# EasyEDA Pro project T113 IoT Station.eprj, schematic Schematic1

## Sheets
1 CPU: Create Date: 2023-01-01; Page Name: CPU; Project Name: T113 IoT Station; Schematic Name: Schematic1; Update Date: 2023-01-26; Company: 嘉立创EDA; Page Size: A3; Version: V1.0
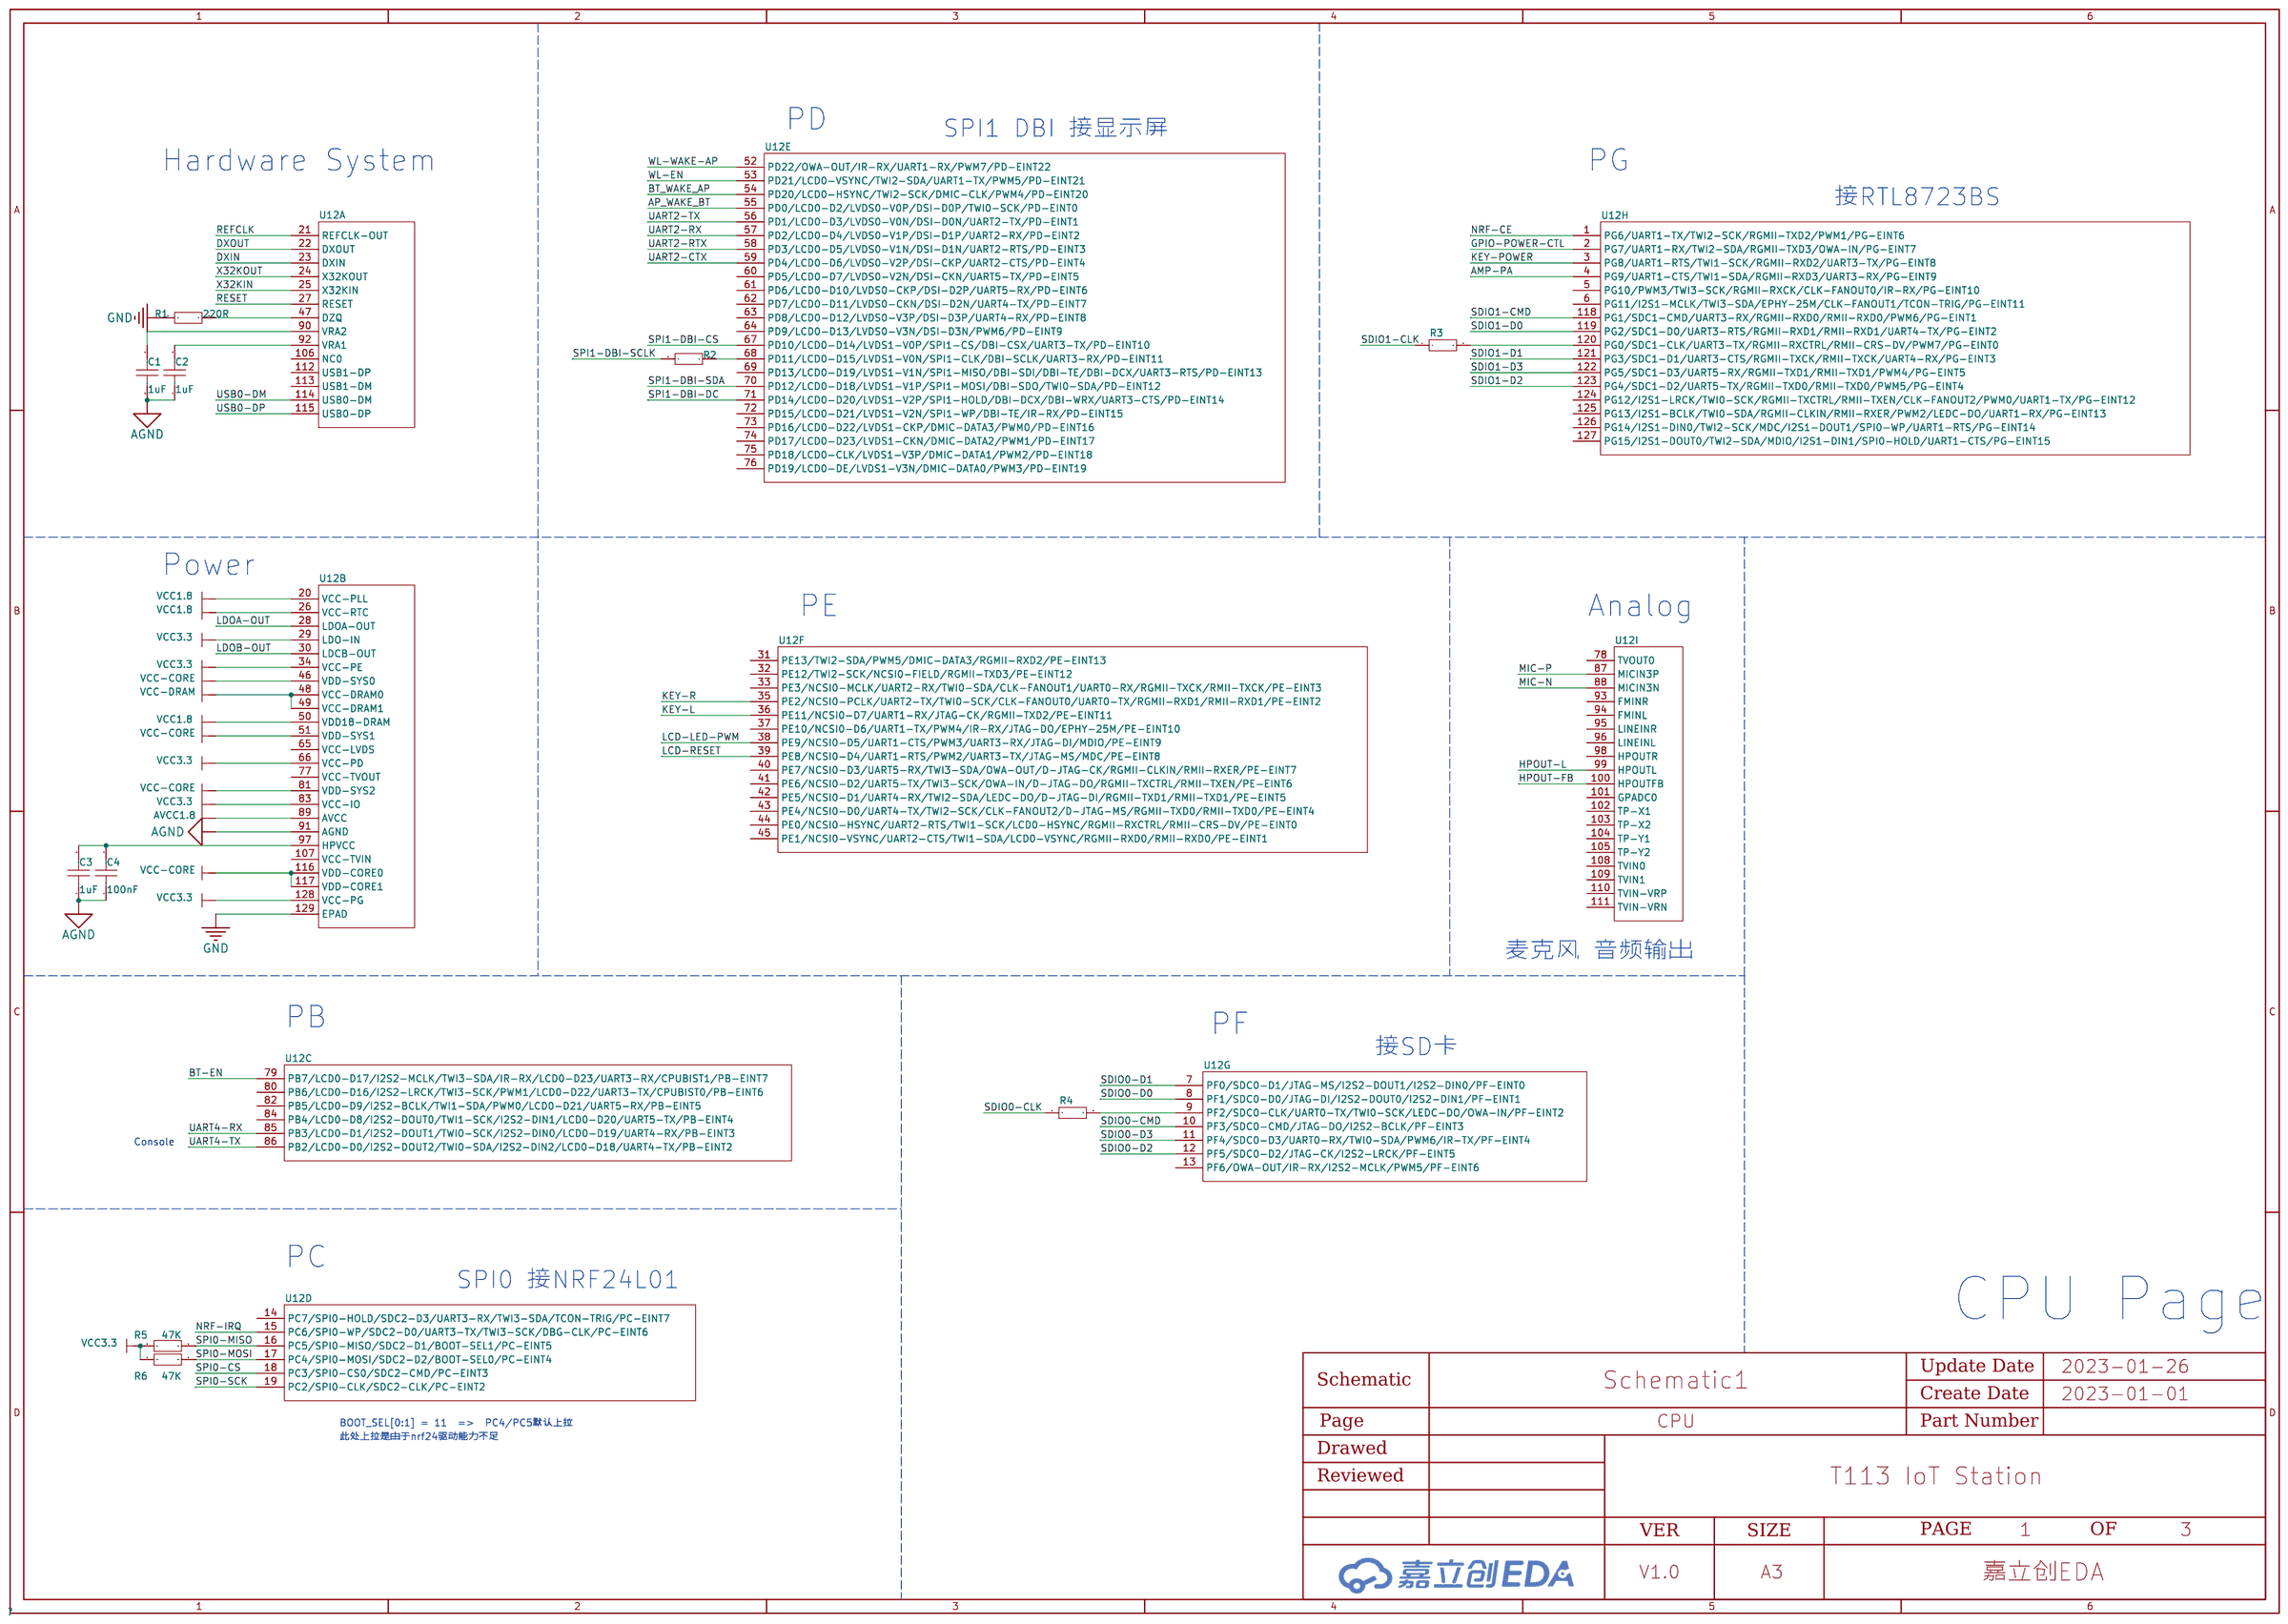
[diagram p0: CPU]
2 Power&System: Page Name: Power&System; Update Date: 2023-01-03; Page Size: A4
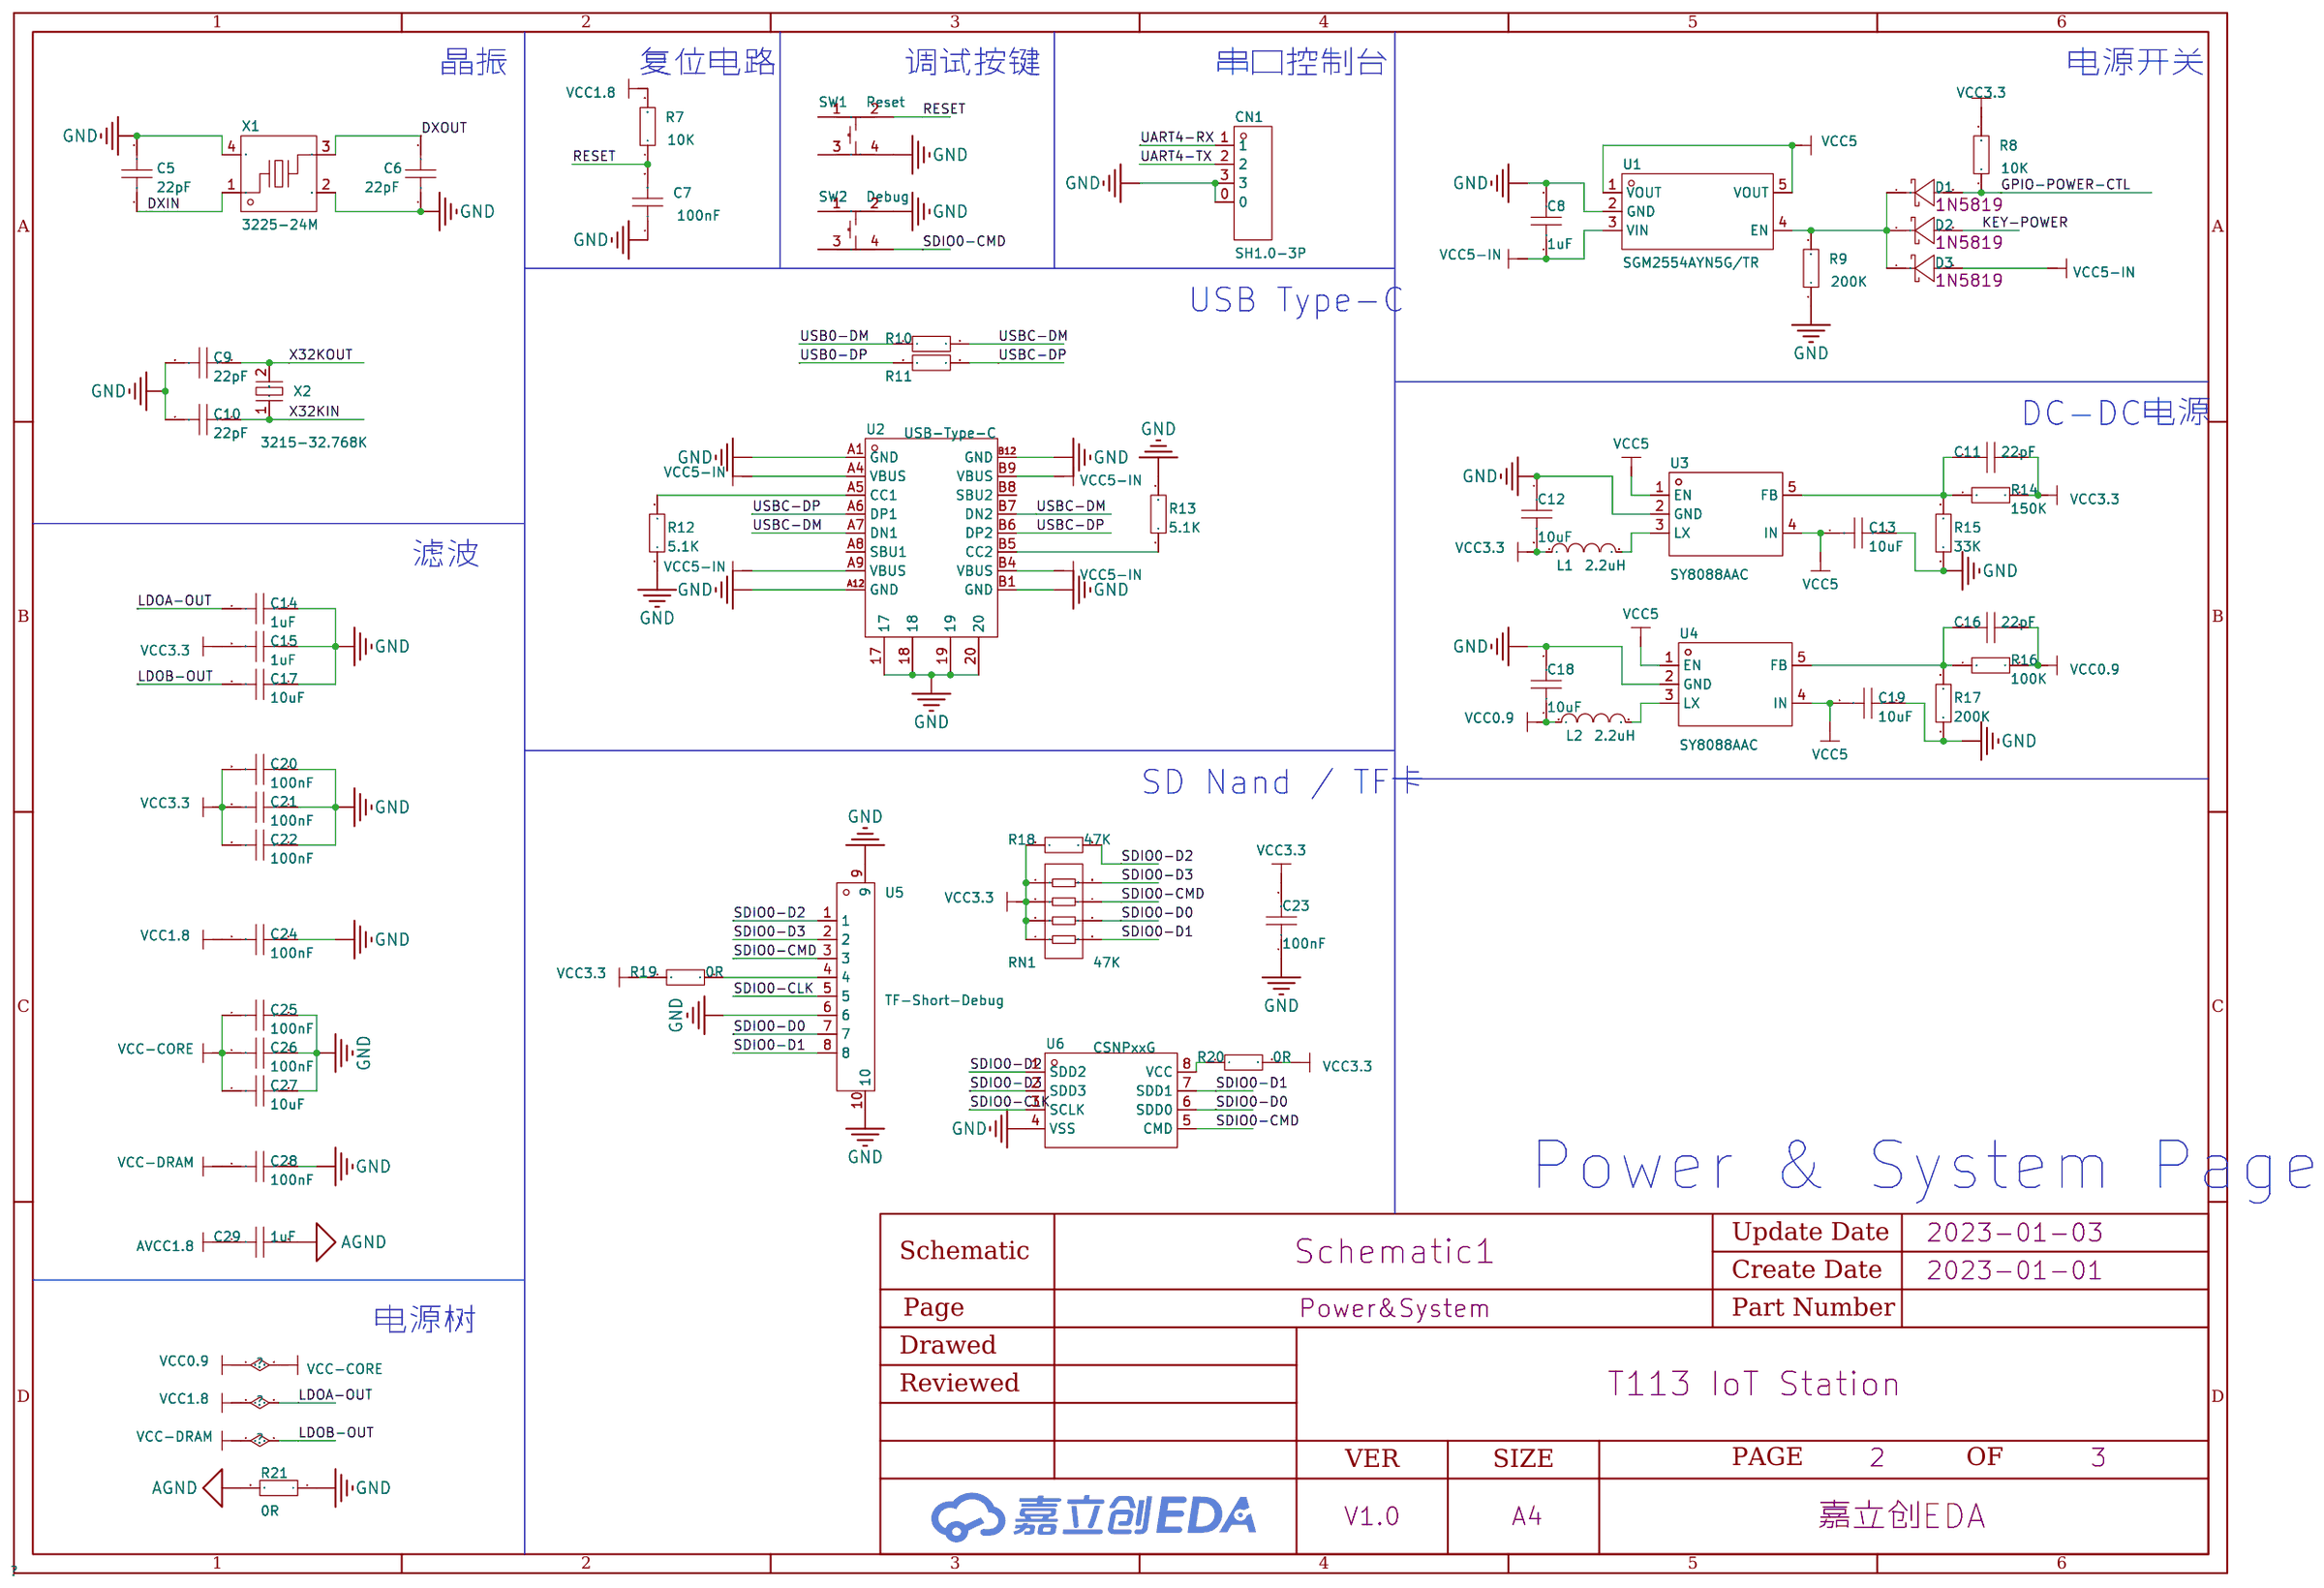
[diagram p1: Power&System]
3 Peripheral: Page Name: Peripheral; Page Size: A4
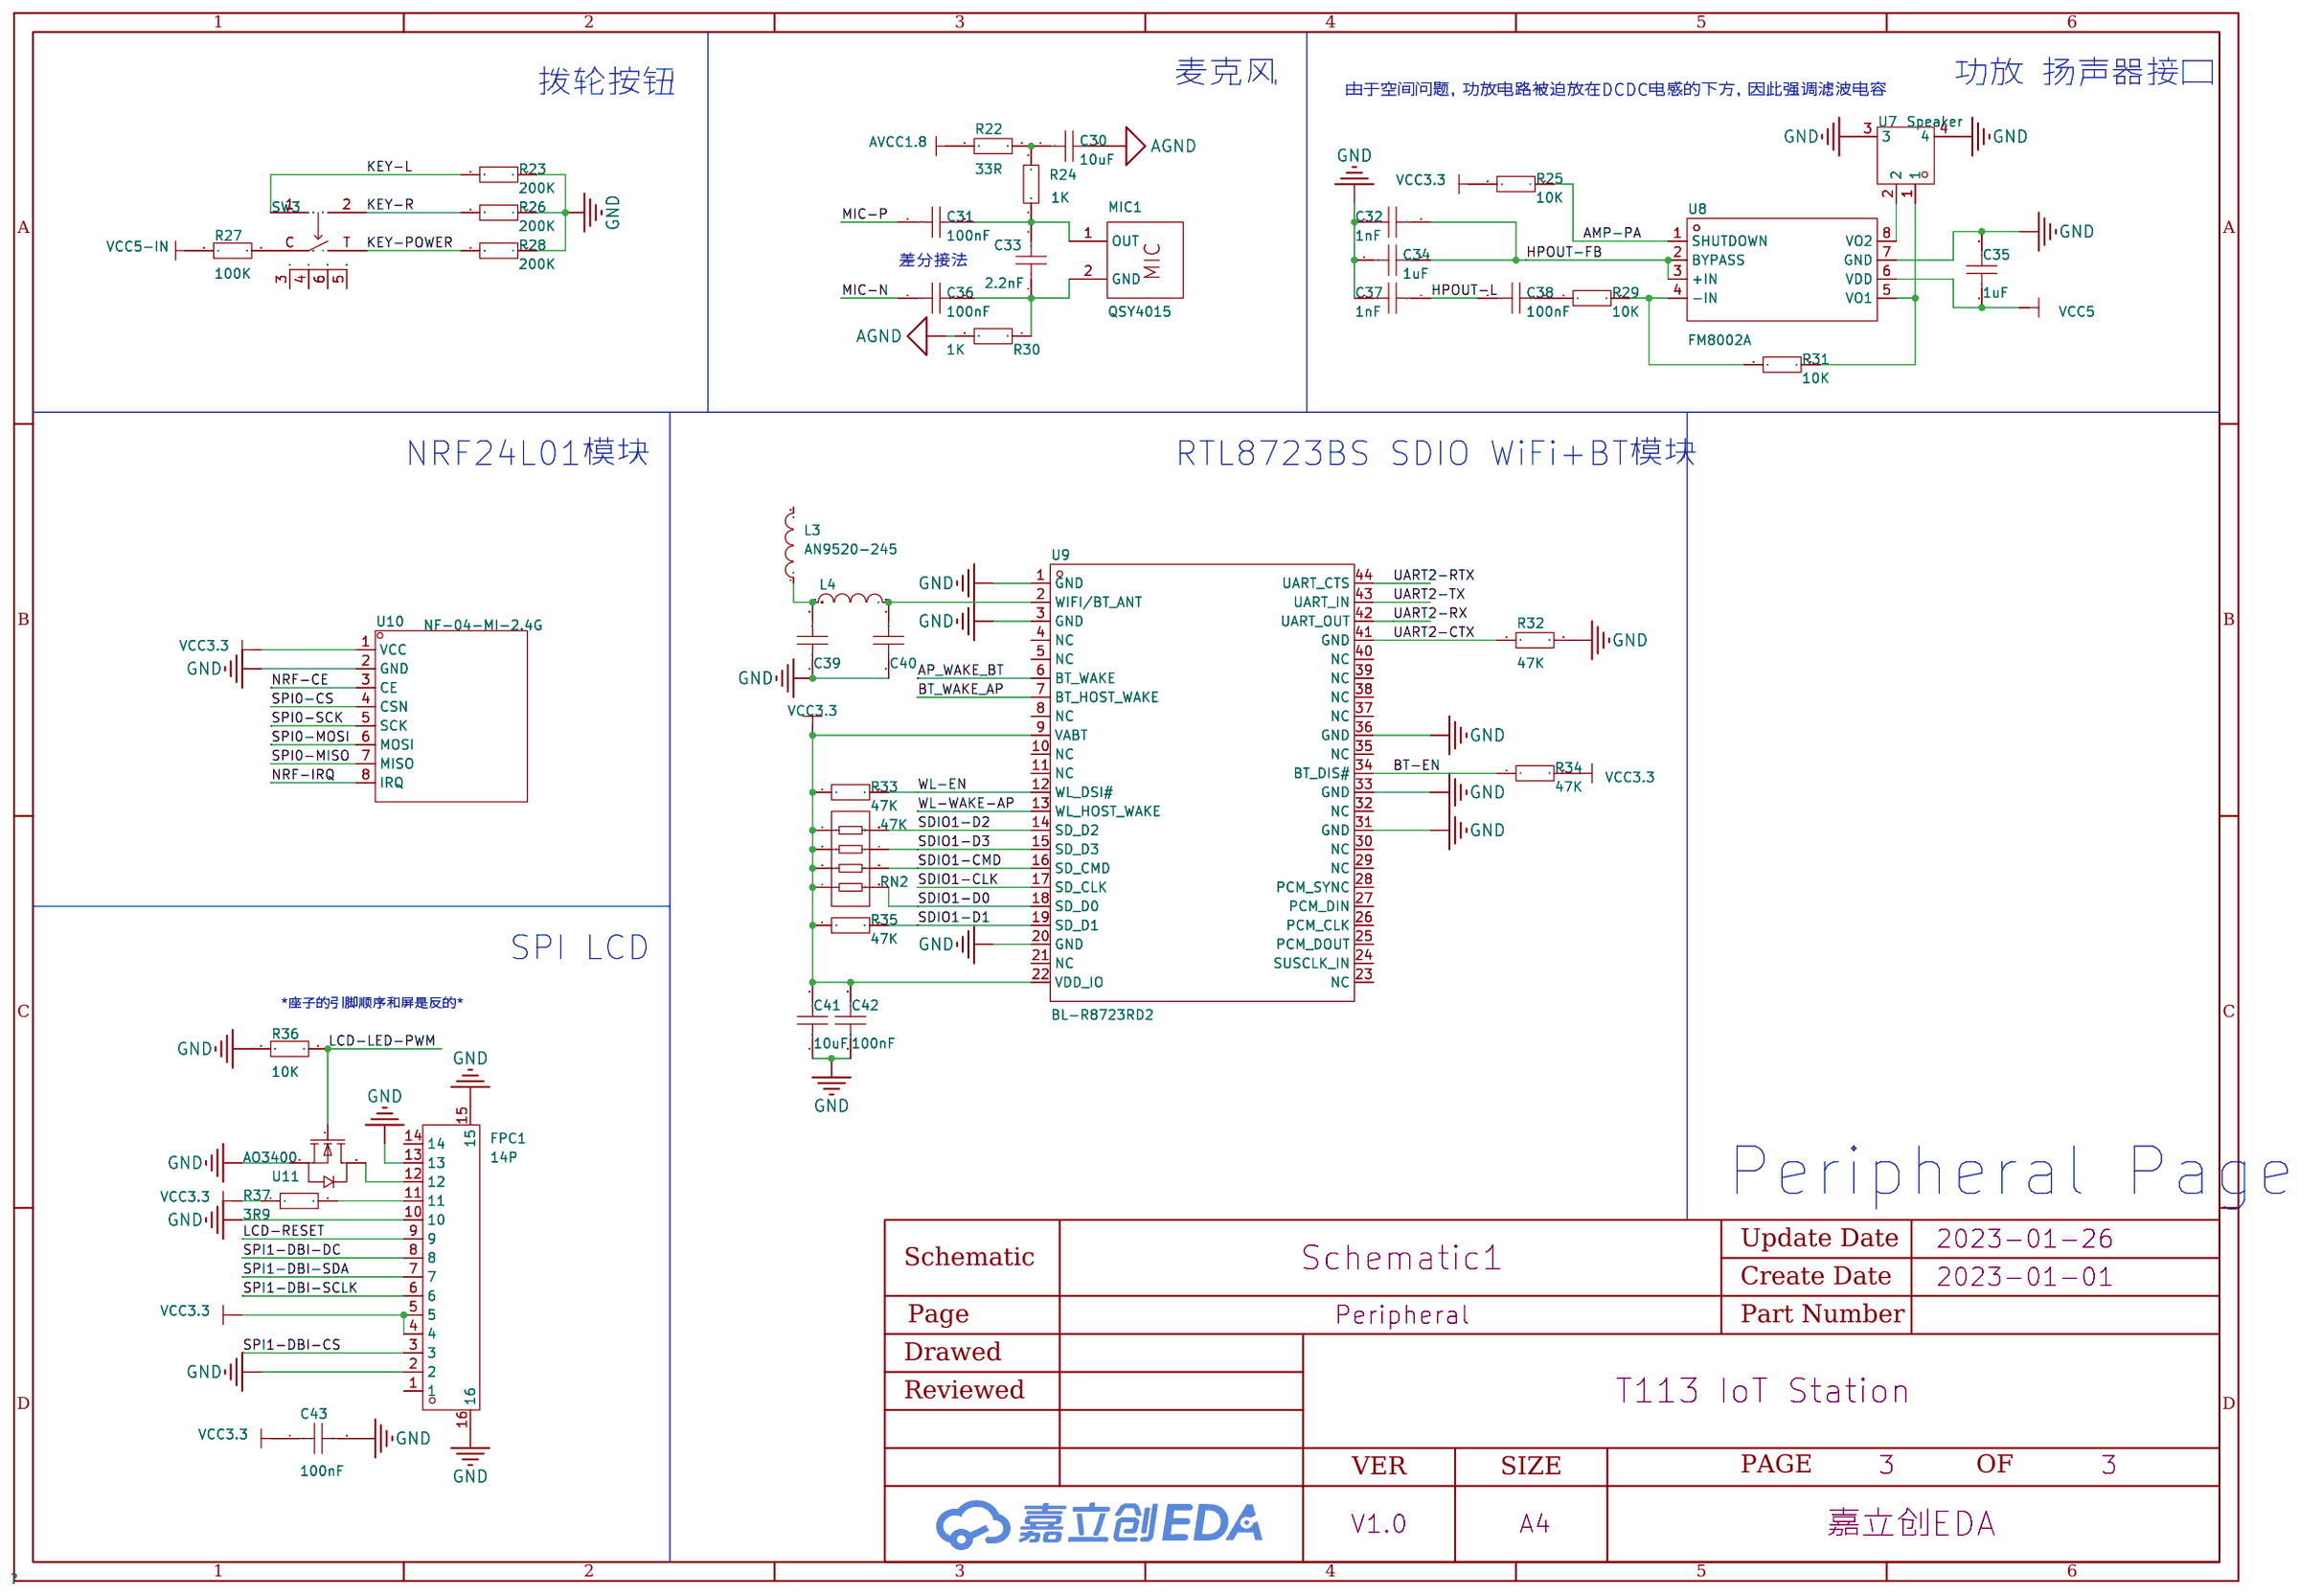
[diagram p2: Peripheral]

## Parts
sheet CPU
C1  1uF  [C0603]
C2  1uF  [C0603]
C3  1uF  [C0603]
C4  100nF  [C0603]
R1  220R  [R0603]
R2  10K  [R0603]
R3  33R  [R0603]
R4  33R  [R0603]
R5  47K  [R0603]
R6  47K  [R0603]
U12  -  [eLQFP-128-5.8]  (sections Analog,PB,PC,PD,PE,PF,PG,Power,System)
sheet Peripheral
C30  10uF  [C0603]
C31  100nF  [C0603]
C32  1nF  [C0603]
C33  2.2nF  [C0603]
C34  1uF  [C0603]
C35  1uF  [C0603]
C36  100nF  [C0603]
C37  1nF  [C0603]
C38  100nF  [C0603]
C39  100nF  [C0402]
C40  100nF  [C0402]
C41  10uF  [C0603]
C42  100nF  [C0603]
C43  100nF  [C0603]
FPC1  14P  [FPC-SMD_14P-P0.50_HDGC_0.5K-AS-14PWB]
L3  AN9520-245  [ANT-SMD_L9.5-W2.1]
L4  2.2nH  [L0402-RD]
MIC1  QSY4015  [MIC-TH_BD4.0-P1.40-D0.3-L]
R22  33R  [R0603]
R23  200K  [R0603]
R24  1K  [R0603]
R25  10K  [R0603]
R26  200K  [R0603]
R27  100K  [R0603]
R28  200K  [R0603]
R29  10K  [R0603]
R30  1K  [R0603]
R31  10K  [R0603]
R32  47K  [R0603]
R33  47K  [R0603]
R34  47K  [R0603]
R35  47K  [R0603]
R36  10K  [R0603]
R37  3R9  [R0603]
RN2  47K  [RES-ARRAY-SMD_0603-8P-L3.2-W1.6-BL]
SW3  TM-2023  [SW-SMD_TM-2023-1]
U7  Speaker  [CONN-SMD_2P-P1.25_HANBO_WAFER-125W-2A]
U8  FM8002A  [SOP-8_L4.9-W3.9-P1.27-LS6.0-BL]
U9  BL-R8723RD2  [WIFIM-SMD_44P-L12.0-W12.0-P0.90]
U10  NF-04-MI-2.4G  [WIRELM-SMD_NF-04-MI-2.4G]
U11  AO3400  [SOT-23-3_L2.9-W1.3-P1.90-LS2.4-BL-2]
sheet Power&System
C5  22pF  [C0402]
C6  22pF  [C0402]
C7  100nF  [C0603]
C8  1uF  [C0603]
C9  22pF  [C0402]
C10  22pF  [C0402]
C11  22pF  [C0402]
C12  10uF  [C0603]
C13  10uF  [C0603]
C14  1uF  [C0603]
C15  1uF  [C0603]
C16  22pF  [C0402]
C17  10uF  [C0603]
C18  10uF  [C0603]
C19  10uF  [C0603]
C20  100nF  [C0603]
C21  100nF  [C0603]
C22  100nF  [C0603]
C23  100nF  [C0603]
C24  100nF  [C0603]
C25  100nF  [C0603]
C26  100nF  [C0603]
C27  10uF  [C0603]
C28  100nF  [C0603]
C29  1uF  [C0603]
CN1  SH1.0-3P  [CONN-SMD_3P-P1.00-L5.0-W5.0]
D1  1N5819  [SOD-323_L1.6-W1.3-LS2.7-RD]
D2  1N5819  [SOD-323_L1.6-W1.3-LS2.7-RD]
D3  1N5819  [SOD-323_L1.6-W1.3-LS2.7-RD]
L1  2.2uH  [IND-SMD_L3.0-W3.0]
L2  2.2uH  [IND-SMD_L3.0-W3.0]
R7  10K  [R0603]
R8  10K  [R0603]
R9  200K  [R0603]
R10  90R  [R0603]
R11  90R  [R0603]
R12  5.1K  [R0603]
R13  5.1K  [R0603]
R14  150K  [R0603]
R15  33K  [R0603]
R16  100K  [R0603]
R17  200K  [R0603]
R18  47K  [R0603]
R19  0R  [R0603]
R20  0R  [R0603]
R21  0R  [R0603]
RN1  47K  [RES-ARRAY-SMD_0603-8P-L3.2-W1.6-BL]
SW1  Reset  [SW-SMD_4P-L3.5-W3.4-P2.20-LS4.2]
SW2  Debug  [SW-SMD_4P-L3.5-W3.4-P2.20-LS4.2]
U1  SGM2554AYN5G/TR  [SOT-23-5_L3.0-W1.7-P0.95-LS2.8-BR]
U2  USB-Type-C  [USB-C-SMD_KH-TYPE-C-CB.W-16P]
U3  SY8088AAC  [SOT-23-5_L3.0-W1.7-P0.95-LS2.8-BR]
U4  SY8088AAC  [SOT-23-5_L3.0-W1.7-P0.95-LS2.8-BR]
U5  TF-Short-Debug  [TF-SMD_TF-021B-H265-C9900005422]
U6  CSNPxxG  [LGA-8_L8.0-W6.2-TL]
X1  3225-24M  [CRYSTAL-SMD_4P-L3.2-W2.5-BL_SIT8008BI]
X2  3215-32.768K  [CRYSTAL-SMD_L3.2-W1.5-FC-135R32.7680KF-A3]

## Library data of the parts
C1-C38 C41-C43 = CAP_0603: Supplier Footprint: 0603
R1-R37 = Res_0603: Supplier Footprint: 0603
U12 = T113-S3
C39 C40 = CL05B104KB54PNC: 容值:100nF;精度:±10%;额定电压:50V;材质(温度系数):X7R;; LCSC Part Name: 100nF ±10% 50V; Supplier Part: C307331; Manufacturer: SAMSUNG(三星); Supplier Footprint: 0402; JLCPCB Part Class: Basic Part; Datasheet: https://atta.szlcsc.com/upload/public/pdf/source/20181009/C307331_222F7C870FD3EA5F46F538B483443886.pdf; Supplier: LCSC; Tolerance: ±10%; Voltage Rated: 50V; Temperature Coefficient: X7R
FPC1 = 0.5K-AS-14PWB: 间距:0.5mm;触点数量:14;锁定特性:抽屉式;安装类型:卧贴;触点类型:上接;工作温度范围:-20℃~+85℃;; LCSC Part Name: 0.5mm P数:14 抽屉式 上接; Supplier Part: C2911757; Manufacturer: HDGC(华德共创); Supplier Footprint: SMD,P=0.5mm; JLCPCB Part Class: 扩展库; Datasheet: https://atta.szlcsc.com/upload/public/pdf/source/20211029/A754EE7947D21442D1C5341E4B9485D9.pdf; Supplier: LCSC; Pitch: 0.5mm; Number of Contacts: 14; Locking Feature: 抽屉式; Mounting Type: 卧贴; Contact Type: 上接; Height Above Board: 2mm; FFC, FCB Thickness: 0.3mm; Operating Temperature Range: -20℃~+85℃
L3 = AN9520-245: 2.4G陶瓷天线/适用于WIFI蓝牙; Supplier Part: C99665; Manufacturer: rainsun(霖昱微); Supplier Footprint: SMD,9.5x2.1mm; JLCPCB Part Class: 扩展库; Datasheet: https://atta.szlcsc.com/upload/public/pdf/source/20170425/1493115807294.pdf; Supplier: LCSC
L4 = SDCL1005C2N2STDFM02: 电感值:2.2nH;精度:±0.3nH;额定电流:-;饱和电流(Isat):-;直流电阻(DCR):-;; LCSC Part Name: 2.2nH ±0.3nH; Supplier Part: C370208; Manufacturer: Sunlord(顺络); Supplier Footprint: 0402; JLCPCB Part Class: Extended Part; Datasheet: https://atta.szlcsc.com/upload/public/pdf/source/20210916/2389196E6DC4CA1121B2D3610B126F46.pdf; Supplier: LCSC; Tolerance: ±0.3nH
MIC1 = B4012AP422-003: LCSC Part Name: 驻极体电容φ4.0*1.2mm 1.1V-10V 灵敏度-42dB; Supplier Part: C233791; Manufacturer: Goertek(歌尔); Supplier Footprint: 插件; JLCPCB Part Class: 扩展库; Datasheet: https://atta.szlcsc.com/upload/public/pdf/source/20180813/C233791_EB931036CBE94BDAE55CF8920DD0A876.pdf; Supplier: LCSC
RN1 RN2 = 4D03WGF4702T5E: 阻值:47kΩ;精度:±1%;单个元件功率:62.5mW;温度系数:±200ppm/℃;电阻器数:4;引脚数:8;; LCSC Part Name: 47kΩ ±1%; Supplier Part: C425205; Manufacturer: UNI-ROYAL(厚声); Supplier Footprint: 0603x4; JLCPCB Part Class: 扩展库; Datasheet: https://atta.szlcsc.com/upload/public/pdf/source/20190904/C425205_39C055B61BC6450B3A5566E7DE8F575E.pdf; Supplier: LCSC; Tolerance: ±1%; Power(Watts): 62.5mW; Temperature Coefficient: ±200ppm/℃; Number of Resistors: 4; Number of Pins: 8
SW3 = TM-2023: 3挡拨轮开关  音响周边开关 多功能开关上中下按键; LCSC Part Name: 3挡拨轮开关; Supplier Part: C318951; Manufacturer: XKB Connectivity(中国星坤); Supplier Footprint: SMD; JLCPCB Part Class: 扩展库; Datasheet: https://atta.szlcsc.com/upload/public/pdf/source/20211015/4E21B3A9DEF1E687333BA1DF36F89D09.pdf; Supplier: LCSC
U7 = UK-1.25-2AWT: 间距:1.25mm;排数:1;每排PIN数:2;公母:公型插针;安装方式:卧贴;额定电流:1A;工作温度范围:-25℃~+85℃;; LCSC Part Name: 1.25mm 卧贴 卧式; Supplier Part: C2997376; Manufacturer: USAKRO(美韩); Supplier Footprint: SMD,P=1.25mm; Datasheet: https://atta.szlcsc.com/upload/public/pdf/source/20220419/24A4256629D7E8D61BFE5BCA4B394246.pdf; Supplier: LCSC; Pitch: 1.25mm; Number of Rows: 1; Number of PINs Per Row: 2; Gender: 公型插针; Mounting Style: 卧贴; Current Rating (Max): 1A; Operating Temperature Range: -25℃~+85℃
U8 = FM8002A: 功放类型:-;扬声器通道数:1通道(单声道);输出功率:2Wx1@4Ω;; Supplier Part: C94625; Manufacturer: FM(富满); Supplier Footprint: SOP-8; JLCPCB Part Class: 扩展库; Datasheet: https://atta.szlcsc.com/upload/public/pdf/source/20170211/1486785664274.pdf; Supplier: LCSC; Speaker Channels: 1通道(单声道); Output Power: 2Wx1@4Ω; Supply Voltage: 2.5V~5.5V
U9 = BL-R8723BS2: Supplier Part: C9900000432; Supplier Footprint: SMD-44_12.0x12.0x0.90P; JLCPCB Part Class: 扩展库; Datasheet: https://atta.szlcsc.comnull; Supplier: LCSC
U10 = NF-04-MI-2.4G: 迷你 无线模块 2.4G模块 无线串口模块 贴片 插件两用; LCSC Part Name: NF-04-MI-2.4G 迷你 无线串口; Supplier Part: C129093; Manufacturer: Ai-Thinker(安信可); Supplier Footprint: Module; JLCPCB Part Class: 扩展库; Datasheet: https://atta.szlcsc.com/upload/public/pdf/source/20170914/C129093_1505359896154968085.pdf; Supplier: LCSC
U11 = AO3400: Supplier Part: C9900013365; Supplier Footprint: SOT23; JLCPCB Part Class: 扩展库; Datasheet: 2022-04-08/830516A/bc9ad5c09bcf47d2b260b07161827fa1/AO3400A.PDF; Supplier: LCSC
CN1 = SH1.0-3P: Supplier Part: C9900019066; JLCPCB Part Class: 扩展库; Datasheet: https://atta.szlcsc.comnull; Supplier: LCSC
D1-D3 = 1N5819WS_C727116: 二极管配置:独立式;直流反向耐压(Vr):40V;平均整流电流(Io):1A;正向压降(Vf):900mV@3A;反向电流(Ir):1mA@40V;; LCSC Part Name: 40V 1A 900mV@3A; Supplier Part: C727116; Manufacturer: TWGMC(台湾迪嘉); Supplier Footprint: SOD-323; JLCPCB Part Class: Extended Part; Datasheet: https://atta.szlcsc.com/upload/public/pdf/source/20200828/C727114_C14023D00363B04EEE1ED2B617BD8BD7.pdf; Supplier: LCSC; Diode Configuration: 独立式; Reverse Voltage (Vr): 40V; Average Rectified Current (Io): 1A; Forward Voltage (Vf@If): 900mV@3A; Reverse Leakage Current (Ir): 1mA@40V
L1 L2 = SWPA3015S2R2MT: 电感值:2.2uH;精度:±20%;额定电流:2A;直流电阻(DCR):-;; LCSC Part Name: 2.2uH ±20% 2A; Supplier Part: C43389; Manufacturer: Sunlord(顺络); Supplier Footprint: SMD; JLCPCB Part Class: 扩展库; Datasheet: https://atta.szlcsc.com/upload/public/pdf/source/20210916/AC798BA7E846B7D0B6818F45CD84DB0B.pdf; Supplier: LCSC; Tolerance: ±20%; Rated Current: 2A
SW1 SW2 = TS-1177-C-A-B: 触点电流:50mA;额定电压(DC):12V;绝缘电阻:100mΩ;电路结构:单刀单掷;安装方式:立贴;按钮形状:圆形按钮;按钮/盖帽颜色:黑色;带灯:无;作用力:260gf;机械寿命:100000;工作温度:-30℃~+85℃;开关长度:3.3mm;开关宽度:3.3mm;开关高度:1.5mm;带支架:否;; LCSC Part Name: 331.5mm 260力度黑色; Supplier Part: C561511; Manufacturer: XKB Connectivity(中国星坤); Supplier Footprint: SMD; JLCPCB Part Class: 扩展库; Datasheet: https://atta.szlcsc.com/upload/public/pdf/source/20200227/C381051_5D04685EB5FF241FBB7989BFC34CAD1B.pdf; Supplier: LCSC; Contact Current: 50mA; Voltage Rating (DC): 12V; Insulation Resistance: 100mΩ; Circuit: 单刀单掷; Mounting Style: 立贴; Actuator Style: 圆形按钮; Actuator/Cap Color: 黑色; With Lamp: 无; Operating Force: 260gf; Mechanical Life: 100000; Operating Temperature: -30℃~+85℃; Switch Length: 3.3mm; Switch Width: 3.3mm; Switch Height: 1.5mm; Strike Gundam: 否
U1 = SGM2554AYN5G/TR: 1.85A限流保护开关，MOSFET开关，压降小 带EN使能控制端; Supplier Part: C183309; Manufacturer: SGMICRO(圣邦微); Supplier Footprint: SOT-23-5; JLCPCB Part Class: 扩展库; Datasheet: https://atta.szlcsc.com/upload/public/pdf/source/20180228/C183309_15198093960171379367.pdf; Supplier: LCSC
U2 = USB-TYPE_C16P沉: Supplier Part: C9900001620; Supplier Footprint: TYPE_C沉板1.6; JLCPCB Part Class: 扩展库; Datasheet: 2021-11-09/246717Z/1e09f6e535fe4106b541e0e2075b394b/TYPEC16pin沉.pdf; Supplier: LCSC
U3 U4 = SY8088AAC: 功能类型:降压型;同步整流:-;输出通道数:-;拓扑结构:-;输入电压:-;输出电流(最大值):-;开关频率:-;; LCSC Part Name: 降压型; Supplier Part: C79313; Manufacturer: silergy(矽力杰); Supplier Footprint: SOT-23-5; JLCPCB Part Class: 扩展库; Datasheet: https://atta.szlcsc.com/upload/public/pdf/source/20170329/1490752163260.pdf; Supplier: LCSC; Function: 降压型
U5 = TF短体卡座-3.35H: Supplier Part: C9900011368; Supplier Footprint: TF-021B-3.35; JLCPCB Part Class: 扩展库; Datasheet: https://atta.szlcsc.comnull; Supplier: LCSC
U6 = CSNP32GCR01-AOW: SD NAND 二代，免驱动使用，标准SDIO接口，兼容SPI/SD/eMMC接口，兼容各大MCU平台;内置EDC/ECC，坏块管理，垃圾回收算法;可机贴，锁定晶圆和控制器,一致性高；通过1万次随机掉电测试，标准SD2.0协议，尺寸6.2x8mm。 CS(创世) SD NAND也被很多开发者朋友称为：贴片式TF卡，贴片式SD卡，贴片卡，焊接式SD卡，焊接式TF卡，工业级TF卡，工业级SD卡，嵌入式SD卡等。主要解决了主控(比如STM32系列的MCU单片机 )使用 SLC NAND FLASH,SPI NA; LCSC Part Name: 32Gb SD NAND 二代 二代; Supplier Part: C2841139; Manufacturer: CS(创世); Supplier Footprint: LGA-8; JLCPCB Part Class: 扩展库; Datasheet: https://atta.szlcsc.com/upload/public/pdf/source/20210628/C2841139_770BD785495677B0240BDE699CBAC374.pdf; Supplier: LCSC
X1 = 3225: Supplier Part: C9900023237; Supplier Footprint: SMD-4P; JLCPCB Part Class: 扩展库; Supplier: LCSC
X2 = FC-135 32.7680KA-A0: LCSC Part Name: 32.768kHz   12.5pF; Supplier Part: C2650444; Manufacturer: EPSON(爱普生); Supplier Footprint: SMD-2P; Datasheet: https://atta.szlcsc.com/upload/public/pdf/source/20211127/C2650444_3DEB46927A758E75F8CF3F6FA0A6BD9B.pdf; Supplier: LCSC

## Nets
AGND: C1.1 C2.1 C3.1 C4.1 C29.2 C30.2 R21.2 R30.2 U12.91(AGND)
AVCC1.8: C29.1 R22.1 U12.89(AVCC)
GND: C5.2 C6.1 C7.1 C8.2 C9.2 C10.2 C12.1 C13.2 C14.1 C15.1 C17.1 C18.2 C19.2 C20.1 C21.1 C22.1 C23.1 C24.1 C25.2 C26.2 C27.2 C28.2 C32.1 C34.1 C35.2 C37.2 C39.1 C40.1 C41.1 C42.1 C43.2 CN1.0 CN1.3 FPC1.2 FPC1.10 FPC1.13 FPC1.15 FPC1.16 R1.1 R9.1 R12.1 R13.2 R15.1 R17.1 R21.1 R23.1 R26.1 R28.1 R32.2 R36.2 SW1.4 SW2.2 U1.2(GND) U2.17 U2.18 U2.19 U2.20 U2.A1(GND) U2.A12(GND) U2.B1(GND) U2.B12(GND) U3.2(GND) U4.2(GND) U5.6 U5.9 U5.10 U6.4(VSS) U7.3 U7.4 U8.7(GND) U9.1(GND) U9.3(GND) U9.20(GND) U9.31(GND) U9.33(GND) U9.36(GND) U10.2(GND) U11.2(S) U12.129(EPAD) X1.2(GND) X1.4(GND)
VCC1.8: C14.2 C24.2 R7.2 U12.20(VCC-PLL) U12.26(VCC-RTC) U12.28(LDOA-OUT) U12.50(VDD18-DRAM)
VCC3.3: C11.2 C12.2 C15.2 C20.2 C21.2 C22.2 C23.2 C41.2 C42.2 C43.1 FPC1.4 FPC1.5 L1.1 R5.1 R6.1 R8.2 R14.2 R18.1 R19.1 R20.2 R25.2 R33.1 R34.2 R35.1 R37.1 RN1.1 RN1.2 RN1.3 RN1.4 RN2.1 RN2.2 RN2.3 RN2.4 U9.9(VABT) U9.22(VDD_IO) U10.1(VCC) U12.29(LDO-IN) U12.34(VCC-PE) U12.66(VCC-PD) U12.83(VCC-IO) U12.128(VCC-PG)
VCC5: C13.1 C19.1 C35.1 U1.1(VOUT) U1.5(VOUT) U3.1(EN) U3.4(IN) U4.1(EN) U4.4(IN) U8.6(VDD)
VCC5-IN: C8.1 D3.2(A) R27.2 U1.3(VIN) U2.A4(VBUS) U2.A9(VBUS) U2.B4(VBUS) U2.B9(VBUS)
VCC-CORE: C16.2 C18.1 C25.1 C26.1 C27.1 L2.1 R16.2 U12.46(VDD-SYS0) U12.51(VDD-SYS1) U12.81(VDD-SYS2) U12.116(VDD-CORE0) U12.117(VDD-CORE1)
VCC-DRAM: C17.2 C28.1 U12.30(LDCB-OUT) U12.48(VCC-DRAM0) U12.49(VCC-DRAM1)
AMP-PA: R25.1 U8.1(SHUTDOWN) U12.4(PG9/UART1-CTS/TWI1-SDA/RGMII-RXD3/UART3-RX/PG-EINT9)
AP_WAKE_BT: U9.6(BT_WAKE) U12.55(PD0/LCD0-D2/LVDS0-V0P/DSI-D0P/TWI0-SCK/PD-EINT0)
BT-EN: R34.1 U9.34(BT_DIS#) U12.79(PB7/LCD0-D17/I2S2-MCLK/TWI3-SDA/IR-RX/LCD0-D23/UART3-RX/CPUBIST1/PB-EINT7)
BT_WAKE_AP: U9.7(BT_HOST_WAKE) U12.54(PD20/LCD0-HSYNC/TWI2-SCK/DMIC-CLK/PWM4/PD-EINT20)
DXIN: C5.1 U12.23(DXIN) X1.1
DXOUT: C6.2 U12.22(DXOUT) X1.3
GPIO-POWER-CTL: D1.2(A) R8.1 U12.2(PG7/UART1-RX/TWI2-SDA/RGMII-TXD3/OWA-IN/PG-EINT7)
HPOUT-FB: C32.2 C34.2 U8.2(BYPASS) U8.3(+IN) U12.100(HPOUTFB)
HPOUT-L: C37.1 C38.1 U12.99(HPOUTL)
KEY-L: R23.2 SW3.1 U12.36(PE11/NCSI0-D7/UART1-RX/JTAG-CK/RGMII-TXD2/PE-EINT11)
KEY-POWER: D2.2(A) R28.2 SW3.T U12.3(PG8/UART1-RTS/TWI1-SCK/RGMII-RXD2/UART3-TX/PG-EINT8)
KEY-R: R26.2 SW3.2 U12.35(PE2/NCSI0-PCLK/UART2-TX/TWI0-SCK/CLK-FANOUT0/UART0-TX/RGMII-RXD1/RMII-RXD1/PE-EINT2)
LCD-LED-PWM: R36.1 U11.1(G) U12.38(PE9/NCSI0-D5/UART1-CTS/PWM3/UART3-RX/JTAG-DI/MDIO/PE-EINT9)
LCD-RESET: FPC1.9 U12.39(PE8/NCSI0-D4/UART1-RTS/PWM2/UART3-TX/JTAG-MS/MDC/PE-EINT8)
MIC-N: C36.1 U12.88(MICIN3N)
MIC-P: C31.1 U12.87(MICIN3P)
NRF-CE: U10.3(CE) U12.1(PG6/UART1-TX/TWI2-SCK/RGMII-TXD2/PWM1/PG-EINT6)
NRF-IRQ: U10.8(IRQ) U12.15(PC6/SPI0-WP/SDC2-D0/UART3-TX/TWI3-SCK/DBG-CLK/PC-EINT6)
REFCLK: U12.21(REFCLK-OUT)
RESET: C7.2 R7.1 SW1.2 U12.27(RESET)
SDIO0-CLK: R4.1 U5.5 U6.3(SCLK)
SDIO0-CMD: RN1.7 SW2.4 U5.3 U6.5(CMD) U12.10(PF3/SDC0-CMD/JTAG-DO/I2S2-BCLK/PF-EINT3)
SDIO0-D0: RN1.6 U5.7 U6.6(SDD0) U12.8(PF1/SDC0-D0/JTAG-DI/I2S2-DOUT0/I2S2-DIN1/PF-EINT1)
SDIO0-D1: RN1.5 U5.8 U6.7(SDD1) U12.7(PF0/SDC0-D1/JTAG-MS/I2S2-DOUT1/I2S2-DIN0/PF-EINT0)
SDIO0-D2: R18.2 U5.1 U6.1(SDD2) U12.12(PF5/SDC0-D2/JTAG-CK/I2S2-LRCK/PF-EINT5)
SDIO0-D3: RN1.8 U5.2 U6.2(SDD3) U12.11(PF4/SDC0-D3/UART0-RX/TWI0-SDA/PWM6/IR-TX/PF-EINT4)
SDIO1-CLK: R3.1 U9.17(SD_CLK)
SDIO1-CMD: RN2.6 U9.16(SD_CMD) U12.118(PG1/SDC1-CMD/UART3-RX/RGMII-RXD0/RMII-RXD0/PWM6/PG-EINT1)
SDIO1-D0: RN2.5 U9.18(SD_D0) U12.119(PG2/SDC1-D0/UART3-RTS/RGMII-RXD1/RMII-RXD1/UART4-TX/PG-EINT2)
SDIO1-D1: R35.2 U9.19(SD_D1) U12.121(PG3/SDC1-D1/UART3-CTS/RGMII-TXCK/RMII-TXCK/UART4-RX/PG-EINT3)
SDIO1-D2: RN2.8 U9.14(SD_D2) U12.123(PG4/SDC1-D2/UART5-TX/RGMII-TXD0/RMII-TXD0/PWM5/PG-EINT4)
SDIO1-D3: RN2.7 U9.15(SD_D3) U12.122(PG5/SDC1-D3/UART5-RX/RGMII-TXD1/RMII-TXD1/PWM4/PG-EINT5)
SPI0-CS: U10.4(CSN) U12.18(PC3/SPI0-CS0/SDC2-CMD/PC-EINT3)
SPI0-MISO: R5.2 U10.7(MISO) U12.16(PC5/SPI0-MISO/SDC2-D1/BOOT-SEL1/PC-EINT5)
SPI0-MOSI: R6.2 U10.6(MOSI) U12.17(PC4/SPI0-MOSI/SDC2-D2/BOOT-SEL0/PC-EINT4)
SPI0-SCK: U10.5(SCK) U12.19(PC2/SPI0-CLK/SDC2-CLK/PC-EINT2)
SPI1-DBI-CS: FPC1.3 U12.67(PD10/LCD0-D14/LVDS1-V0P/SPI1-CS/DBI-CSX/UART3-TX/PD-EINT10)
SPI1-DBI-DC: FPC1.8 U12.71(PD14/LCD0-D20/LVDS1-V2P/SPI1-HOLD/DBI-DCX/DBI-WRX/UART3-CTS/PD-EINT14)
SPI1-DBI-SCLK: FPC1.6 R2.1
SPI1-DBI-SDA: FPC1.7 U12.70(PD12/LCD0-D18/LVDS1-V1P/SPI1-MOSI/DBI-SDO/TWI0-SDA/PD-EINT12)
UART2-CTX: R32.1 U9.41(GND) U12.59(PD4/LCD0-D6/LVDS0-V2P/DSI-CKP/UART2-CTS/PD-EINT4)
UART2-RTX: U9.44(UART_CTS) U12.58(PD3/LCD0-D5/LVDS0-V1N/DSI-D1N/UART2-RTS/PD-EINT3)
UART2-RX: U9.42(UART_OUT) U12.57(PD2/LCD0-D4/LVDS0-V1P/DSI-D1P/UART2-RX/PD-EINT2)
UART2-TX: U9.43(UART_IN) U12.56(PD1/LCD0-D3/LVDS0-V0N/DSI-D0N/UART2-TX/PD-EINT1)
UART4-RX: CN1.1 U12.85(PB3/LCD0-D1/I2S2-DOUT1/TWI0-SCK/I2S2-DIN0/LCD0-D19/UART4-RX/PB-EINT3)
UART4-TX: CN1.2 U12.86(PB2/LCD0-D0/I2S2-DOUT2/TWI0-SDA/I2S2-DIN2/LCD0-D18/UART4-TX/PB-EINT2)
USB0-DM: R10.1 U12.114(USB0-DM)
USB0-DP: R11.1 U12.115(USB0-DP)
USBC-DM: R10.2 U2.A7(DN1) U2.B7(DN2)
USBC-DP: R11.2 U2.A6(DP1) U2.B6(DP2)
WL-EN: R33.2 U9.12(WL_DSI#) U12.53(PD21/LCD0-VSYNC/TWI2-SDA/UART1-TX/PWM5/PD-EINT21)
WL-WAKE-AP: U9.13(WL_HOST_WAKE) U12.52(PD22/OWA-OUT/IR-RX/UART1-RX/PWM7/PD-EINT22)
X32KIN: C10.1 U12.25(X32KIN) X2.1
X32KOUT: C9.1 U12.24(X32KOUT) X2.2(GND)
$1N4762: R1.2 U12.47(DZQ)
$1N8912: C2.2 U12.92(VRA1)
$1N8913: C1.2 U12.90(VRA2)
$1N9421: C3.2 C4.2 U12.97(HPVCC)
$1N13284: R4.2 U12.9(PF2/SDC0-CLK/UART0-TX/TWI0-SCK/LEDC-DO/OWA-IN/PF-EINT2)
$1N13383: R3.2 U12.120(PG0/SDC1-CLK/UART3-TX/RGMII-RXCTRL/RMII-CRS-DV/PWM7/PG-EINT0)
$1N18420: R2.2 U12.68(PD11/LCD0-D15/LVDS1-V0N/SPI1-CLK/DBI-SCLK/UART3-RX/PD-EINT11)
$2N4943: L1.2 U3.3(LX)
$2N5364: L2.2 U4.3(LX)
$2N7619: C11.1 R14.1 R15.2 U3.5(FB)
$2N8291: C16.1 R16.1 R17.2 U4.5(FB)
$2N10930: D1.1(K) D2.1(K) D3.1(K) R9.2 U1.4(EN)
$2N17491: R12.2 U2.A5(CC1)
$2N17494: R13.1 U2.B5(CC2)
$2N17497: R19.2 U5.4
$2N17518: R20.1 U6.8(VCC)
$3N5065: R27.1 SW3.C
$3N6722: FPC1.12 U11.3(D)
$3N6869: FPC1.11 R37.2
$3N8494: C31.2 C33.2 MIC1.1(OUT) R24.1
$3N8509: C33.1 C36.2 MIC1.2(GND) R30.1
$3N9217: C30.1 R22.2 R24.2
$3N11166: R29.2 R31.2 U8.4(-IN)
$3N11367: C38.2 R29.1
$3N11510: R31.1 U7.1 U8.5(VO1)
$3N11645: U7.2 U8.8(VO2)
$3N14490: C40.2 L4.2 U9.2(WIFI/BT_ANT)
$3N14921: C39.2 L3.1 L4.1

Not connected (* = marked no-connect by the designer): FPC1 1 14; L3 2; SW1 1 3; SW2 1 3; SW3 3 4 5 6; U2 A8(SBU1) B8(SBU2); U9 4(NC) 5(NC) 8(NC) 10(NC) 11(NC) 21(NC) 23(NC) 24(SUSCLK_IN) 25(PCM_DOUT) 26(PCM_CLK) 27(PCM_DIN) 28(PCM_SYNC) 29(NC) 30(NC) 32(NC) 35(NC) 37(NC) 38(NC) 39(NC) 40(NC); U12 5(PG10/PWM3/TWI3-SCK/RGMII-RXCK/CLK-FANOUT0/IR-RX/PG-EINT10) 6(PG11/I2S1-MCLK/TWI3-SDA/EPHY-25M/CLK-FANOUT1/TCON-TRIG/PG-EINT11) 13(PF6/OWA-OUT/IR-RX/I2S2-MCLK/PWM5/PF-EINT6) 14(PC7/SPI0-HOLD/SDC2-D3/UART3-RX/TWI3-SDA/TCON-TRIG/PC-EINT7) 31(PE13/TWI2-SDA/PWM5/DMIC-DATA3/RGMII-RXD2/PE-EINT13) 32(PE12/TWI2-SCK/NCSI0-FIELD/RGMII-TXD3/PE-EINT12) 33(PE3/NCSI0-MCLK/UART2-RX/TWI0-SDA/CLK-FANOUT1/UART0-RX/RGMII-TXCK/RMII-TXCK/PE-EINT3) 37(PE10/NCSI0-D6/UART1-TX/PWM4/IR-RX/JTAG-DO/EPHY-25M/PE-EINT10) 40(PE7/NCSI0-D3/UART5-RX/TWI3-SDA/OWA-OUT/D-JTAG-CK/RGMII-CLKIN/RMII-RXER/PE-EINT7) 41(PE6/NCSI0-D2/UART5-TX/TWI3-SCK/OWA-IN/D-JTAG-DO/RGMII-TXCTRL/RMII-TXEN/PE-EINT6) 42(PE5/NCSI0-D1/UART4-RX/TWI2-SDA/LEDC-DO/D-JTAG-DI/RGMII-TXD1/RMII-TXD1/PE-EINT5) 43(PE4/NCSI0-D0/UART4-TX/TWI2-SCK/CLK-FANOUT2/D-JTAG-MS/RGMII-TXD0/RMII-TXD0/PE-EINT4) 44(PE0/NCSI0-HSYNC/UART2-RTS/TWI1-SCK/LCD0-HSYNC/RGMII-RXCTRL/RMII-CRS-DV/PE-EINT0) 45(PE1/NCSI0-VSYNC/UART2-CTS/TWI1-SDA/LCD0-VSYNC/RGMII-RXD0/RMII-RXD0/PE-EINT1) 60(PD5/LCD0-D7/LVDS0-V2N/DSI-CKN/UART5-TX/PD-EINT5) 61(PD6/LCD0-D10/LVDS0-CKP/DSI-D2P/UART5-RX/PD-EINT6) 62(PD7/LCD0-D11/LVDS0-CKN/DSI-D2N/UART4-TX/PD-EINT7) 63(PD8/LCD0-D12/LVDS0-V3P/DSI-D3P/UART4-RX/PD-EINT8) 64(PD9/LCD0-D13/LVDS0-V3N/DSI-D3N/PWM6/PD-EINT9) 65(VCC-LVDS) 69(PD13/LCD0-D19/LVDS1-V1N/SPI1-MISO/DBI-SDI/DBI-TE/DBI-DCX/UART3-RTS/PD-EINT13) 72(PD15/LCD0-D21/LVDS1-V2N/SPI1-WP/DBI-TE/IR-RX/PD-EINT15) 73(PD16/LCD0-D22/LVDS1-CKP/DMIC-DATA3/PWM0/PD-EINT16) 74(PD17/LCD0-D23/LVDS1-CKN/DMIC-DATA2/PWM1/PD-EINT17) 75(PD18/LCD0-CLK/LVDS1-V3P/DMIC-DATA1/PWM2/PD-EINT18) 76(PD19/LCD0-DE/LVDS1-V3N/DMIC-DATA0/PWM3/PD-EINT19) 77(VCC-TVOUT) 78(TVOUT0) 80(PB6/LCD0-D16/I2S2-LRCK/TWI3-SCK/PWM1/LCD0-D22/UART3-TX/CPUBIST0/PB-EINT6) 82(PB5/LCD0-D9/I2S2-BCLK/TWI1-SDA/PWM0/LCD0-D21/UART5-RX/PB-EINT5) 84(PB4/LCD0-D8/I2S2-DOUT0/TWI1-SCK/I2S2-DIN1/LCD0-D20/UART5-TX/PB-EINT4) 93(FMINR) 94(FMINL) 95(LINEINR) 96(LINEINL) 98(HPOUTR) 101(GPADC0) 102(TP-X1) 103(TP-X2) 104(TP-Y1) 105(TP-Y2) 106(NC0) 107(VCC-TVIN) 108(TVIN0) 109(TVIN1) 110(TVIN-VRP) 111(TVIN-VRN) 112(USB1-DP) 113(USB1-DM) 124(PG12/I2S1-LRCK/TWI0-SCK/RGMII-TXCTRL/RMII-TXEN/CLK-FANOUT2/PWM0/UART1-TX/PG-EINT12) 125(PG13/I2S1-BCLK/TWI0-SDA/RGMII-CLKIN/RMII-RXER/PWM2/LEDC-DO/UART1-RX/PG-EINT13) 126(PG14/I2S1-DIN0/TWI2-SCK/MDC/I2S1-DOUT1/SPI0-WP/UART1-RTS/PG-EINT14) 127(PG15/I2S1-DOUT0/TWI2-SDA/MDIO/I2S1-DIN1/SPI0-HOLD/UART1-CTS/PG-EINT15)

## Notes on the sheets
sheet 1
- PD
- SPI1 DBI 接显示屏
- Hardware System
- PG
- 接RTL8723BS
- Power
- PE
- Analog
- 麦克风 音频输出
- PB
- PF
- 接SD卡
- Console
- PC
- SPI0 接NRF24L01
- CPU Page
- BOOT_SEL[0:1] = 11  =>  PC4/PC5默认上拉
- 此处上拉是由于nrf24驱动能力不足
sheet 2
- 晶振
- 复位电路
- 调试按键
- 串口控制台
- 电源开关
- USB Type-C
- DC-DC电源
- 滤波
- SD Nand / TF卡
- Power & System Page
- 电源树
sheet 3
- 麦克风
- 功放 扬声器接口
- 拨轮按钮
- 由于空间问题，功放电路被迫放在DCDC电感的下方，因此强调滤波电容
- 差分接法
- NRF24L01模块
- RTL8723BS SDIO WiFi+BT模块
- SPI LCD
- *座子的引脚顺序和屏是反的*
- Peripheral Page
